# Altium project PCB_Project.PrjPcb
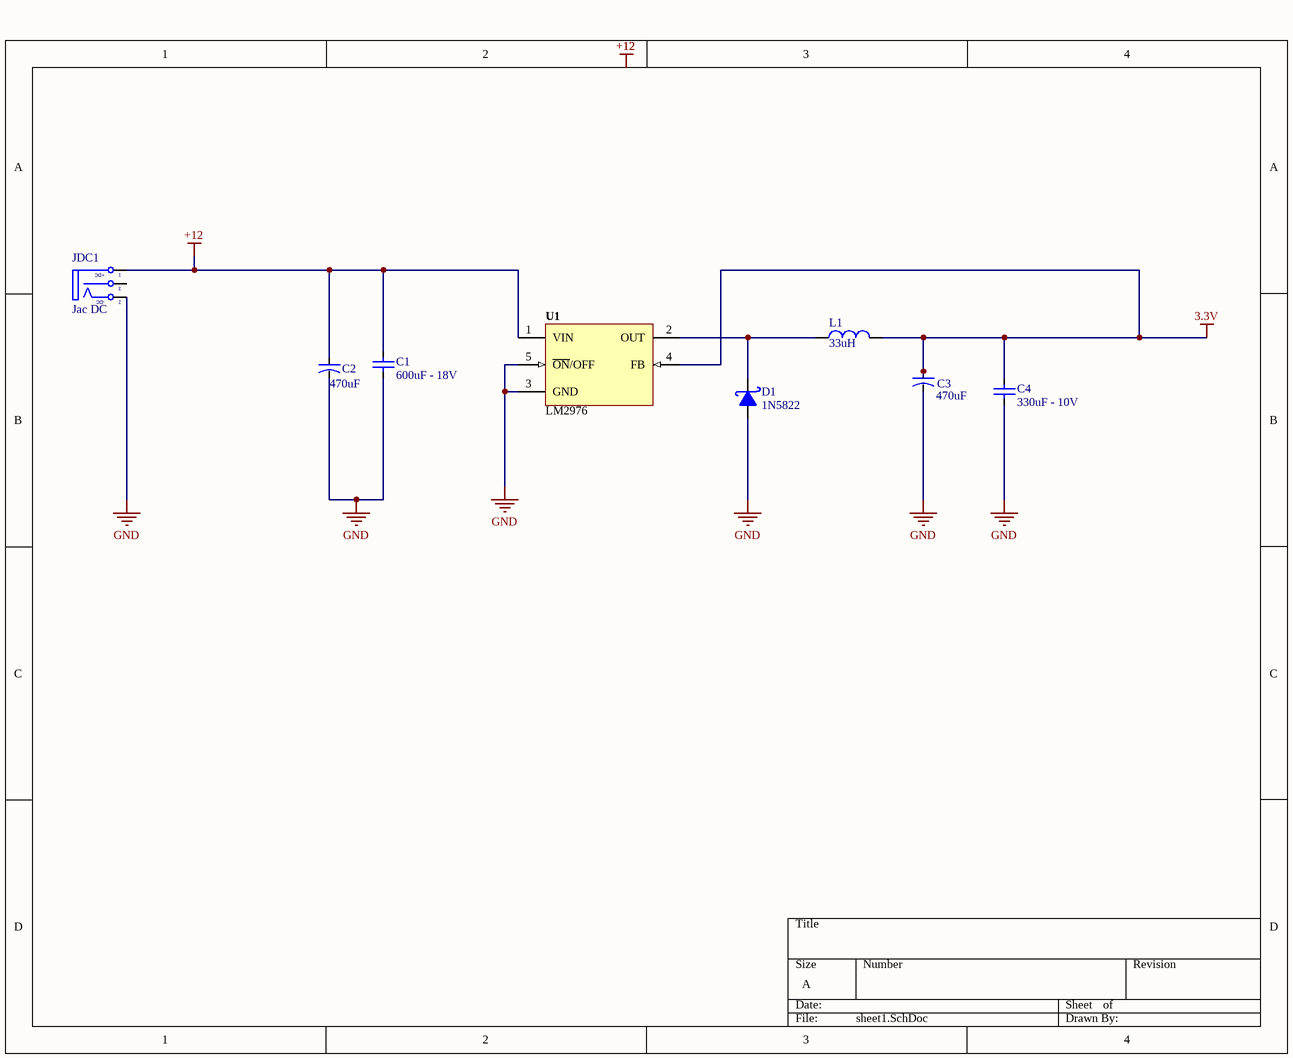
[diagram p0: sheet1.SchDoc]
1 sheet, 8 parts. Net scope: global (net labels, ports and power ports of the same name join across sheets).
Board file: PCB1.PcbDoc

## Sheet sheet1.SchDoc
size A; SheetNumber: 1; SheetTotal: 1

### Parts
C1  600uF - 18V  [103/2KV]
C2  470uF  [CA-ALU-2.54]
C3  470uF  [CAP-ALU-SMD-4.5x5x1.4]
C4  330uF - 10V  [103/2KV]
D1  1N5822  [DIO-SMD-123]
JDC1  Jac DC  [DC-IN]
L1  33uH  [L-SMD-M-12x10]
U1  LM2976  [TO263]

### Nets
3.3V: C3.1 C4.2 L1.2 U1.4(FB)
+12: C1.2 C2.1 JDC1.1(T) U1.1(VIN)
GND: C1.1 C2.2 C3.2 C4.1 D1.1(A) JDC1.2(TN) U1.3(GND) U1.5(~{ON}/OFF)
NetD1_2: D1.2(K) L1.1 U1.2(OUT)

Not connected (* = marked no-connect by the designer): JDC1 3(S)

### Notes on the sheet
- (in symbol DCIN) +DC; -DC

### Library data of the parts
C1 C4 = Cap2KV: Capacitor Ceramic 2KV; Published: 8-Jun-2000; LatestRevisionDate: 17-Jul-2002; LatestRevisionNote: Re-released for DXP Platform.; PackageReference: RAD-0.3; Publisher: Altium Limited
C2 = CAP-ALU-DIP: Capacitor (Semiconductor SIM Model); Value: 104; LatestRevisionDate: 17-Jul-2002; LatestRevisionNote: Re-released for DXP Platform.; PackageReference: C1206; Publisher: Altium Limited
C3 = CAP-ALU-SMD: Polarized Capacitor (Axial); Published: 8-Jun-2000; LatestRevisionDate: 17-Jul-2002; LatestRevisionNote: Re-released for DXP Platform.; PackageReference: POLAR0.8; Publisher: Altium Limited
D1 = 1N5822: Schottky Rectifiers; Value: Diode c?m 1N5408
JDC1 = DCIN: Jac DC input; Value: Jac DC
L1 = Inductor: Value: 150 mH
U1 = LM2596: Max Input Voltage: 12 V; Max Output Current: 3 (6.0 peak) A; Max Output Voltage: mV; Category: IC-Power; Min Input Voltage: mV; Min Output Voltage: mV; Mounting Technology: Surface Mount; Status: Unreleased; Supply Voltage: mV; Temperature Range: -40 to +125 degC